# EAGLE design controller testjig (EAGLE 7.2.0)
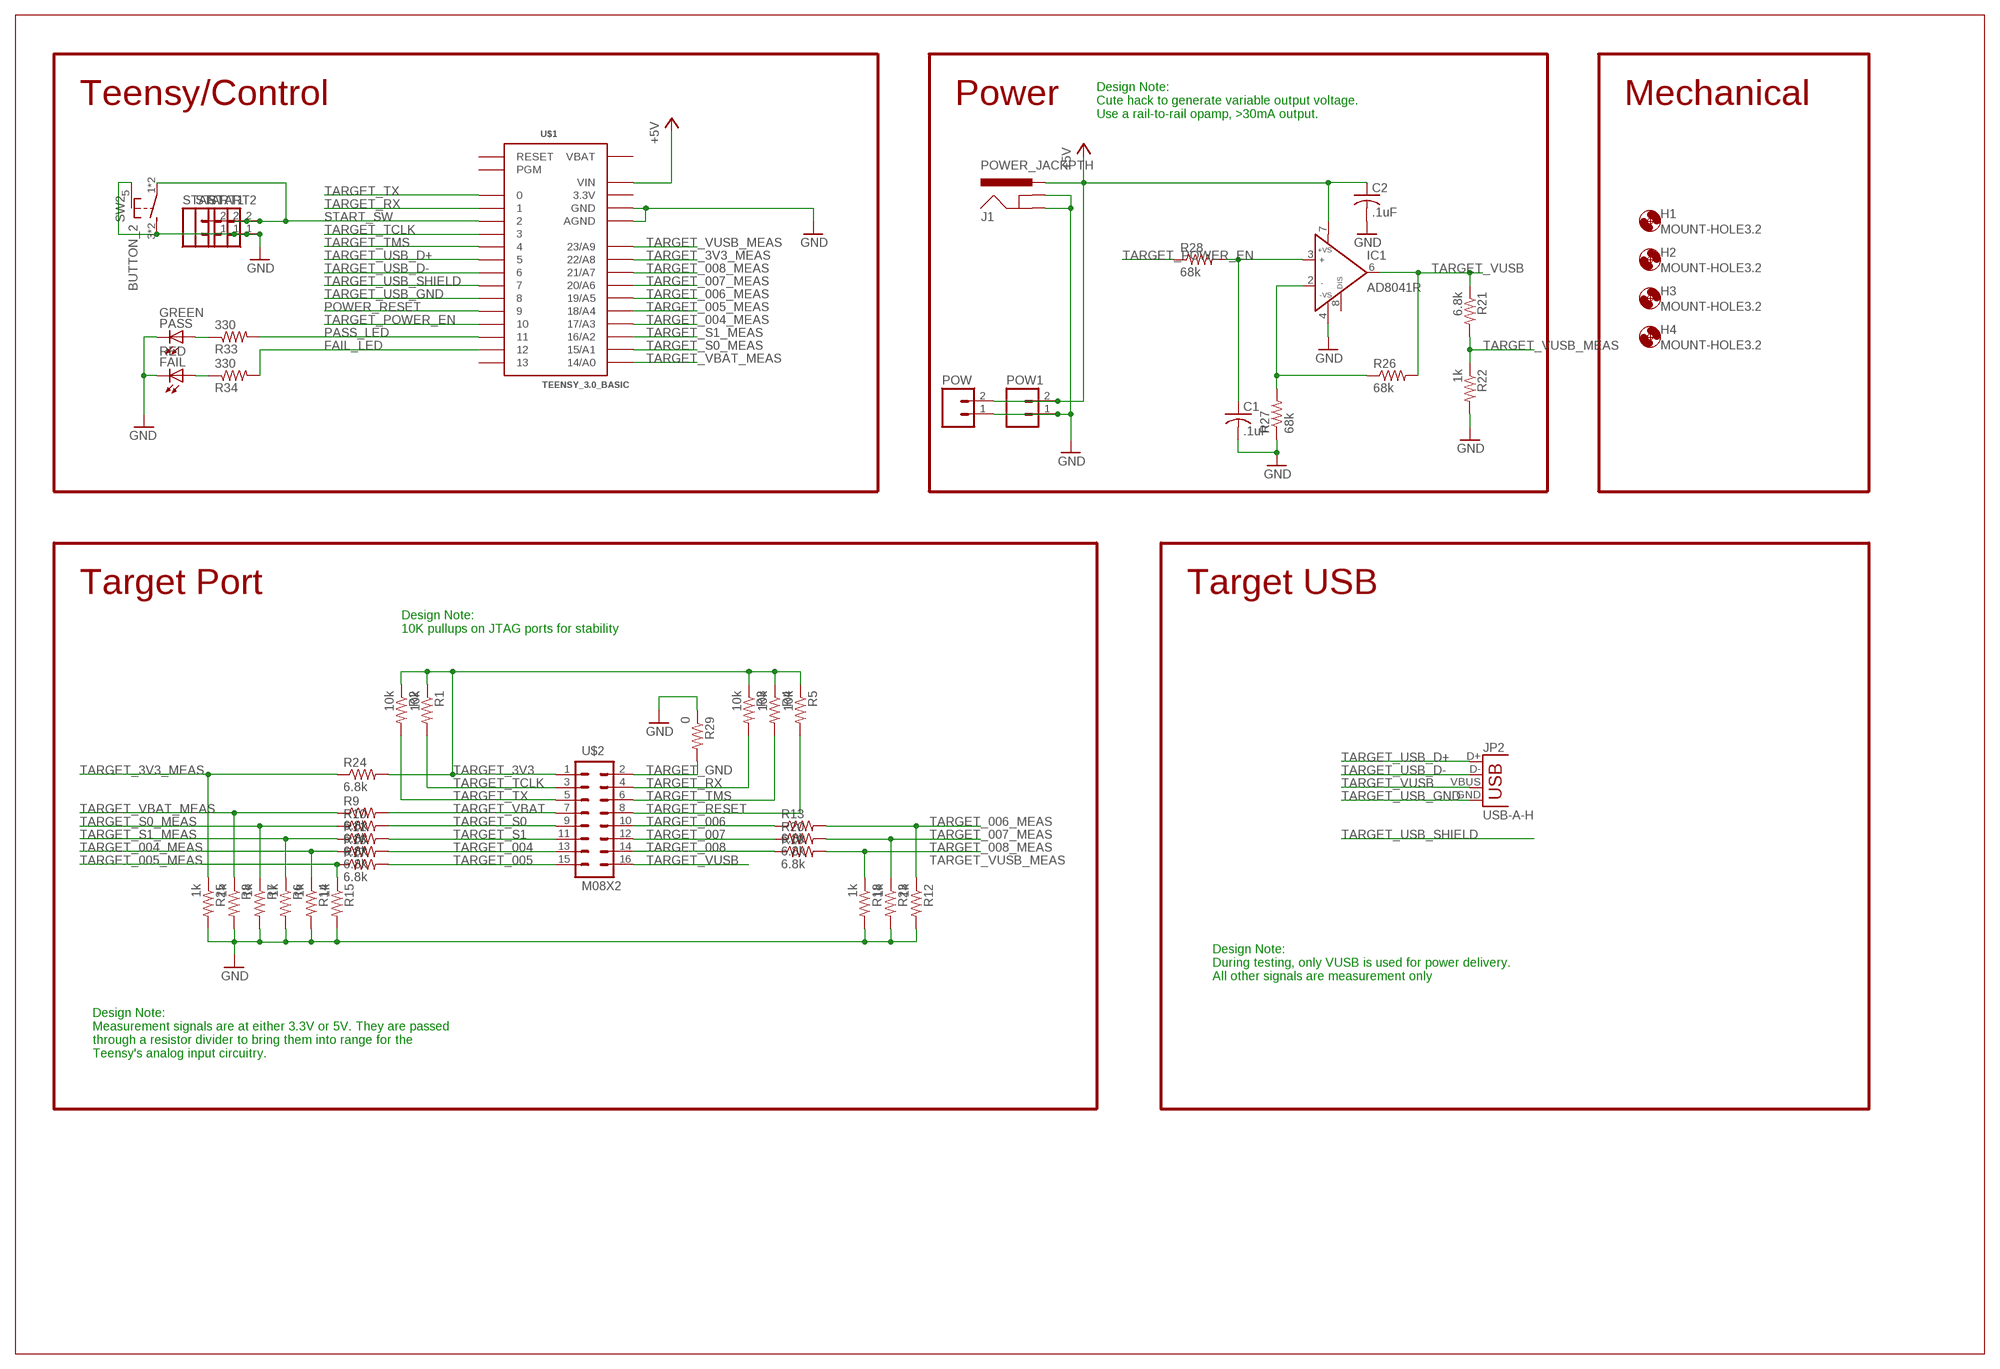
[diagram p0: schematic, sheet 1]

## Parts
C1  .1uF  C-USC0603  [C0603]
C2  .1uF  C-USC0603  [C0603]
FAIL  RED  LED5MM  [LED5MM]
H1  MOUNT-HOLE3.2  [3,2]
H2  MOUNT-HOLE3.2  [3,2]
H3  MOUNT-HOLE3.2  [3,2]
H4  MOUNT-HOLE3.2  [3,2]
IC1  AD8041R  [SO8]
J1  POWER_JACKPTH  [POWER_JACK_PTH]
JP2  USB-A-H  [USB-A-H]
PASS  GREEN  LED5MM  [LED5MM]
POW  M02  [02P]
POW1  M02  [02P]
R1  10k  R-US_R0603  [R0603]
R2  10k  R-US_R0603  [R0603]
R3  10k  R-US_R0603  [R0603]
R4  10k  R-US_R0603  [R0603]
R5  10k  R-US_R0603  [R0603]
R6  1k  R-US_R0603  [R0603]
R7  1k  R-US_R0603  [R0603]
R8  1k  R-US_R0603  [R0603]
R9  6.8k  R-US_R0603  [R0603]
R10  6.8k  R-US_R0603  [R0603]
R11  6.8k  R-US_R0603  [R0603]
R12  1k  R-US_R0603  [R0603]
R13  6.8k  R-US_R0603  [R0603]
R14  1k  R-US_R0603  [R0603]
R15  1k  R-US_R0603  [R0603]
R16  6.8k  R-US_R0603  [R0603]
R17  6.8k  R-US_R0603  [R0603]
R18  1k  R-US_R0603  [R0603]
R19  6.8k  R-US_R0603  [R0603]
R20  6.8k  R-US_R0603  [R0603]
R21  6.8k  R-US_R0603  [R0603]
R22  1k  R-US_R0603  [R0603]
R23  1k  R-US_R0603  [R0603]
R24  6.8k  R-US_R0603  [R0603]
R25  1k  R-US_R0603  [R0603]
R26  68k  R-US_R0603  [R0603]
R27  68k  R-US_R0603  [R0603]
R28  68k  R-US_R0603  [R0603]
R29  0  R-US_R0603  [R0603]
R33  330  R-US_R0603  [R0603]
R34  330  R-US_R0603  [R0603]
START  M02  [02P]
START1  M02  [02P]
START2  M02  [02P]
SW2  BUTTON_2  BUTTON_MOMENTARY_GROUND  [TD-07XB]
U$1  TEENSY_3.0_BASIC  [TEENSY_3.0_BASIC]
U$2  M08X2  [2X8]

## Nets
+5V: C2.1 IC1.7(+VS) J1.PWR POW1.2 POW.2 U$1.VIN
FAIL_LED: R34.2 U$1.12
GND: C1.2 C2.2 FAIL.K(C) IC1.4(-VS) J1.GND J1.GNDBREAK PASS.K(C) POW1.1 POW.1 R6.2 R7.2 R8.2 R12.2 R14.2 R15.2 R18.2 R22.2 R23.2 R25.2 R27.1 R29.1 START1.1 START2.1 START.1 SW2.3(S) SW2.4(S) SW2.5(SHIELD) U$1.AGND U$1.GND U$1.GND1(GND)
GOOD: PASS.A R33.1
N$1: IC1.2(IN-) R26.1 R27.2
N$3: C1.1 IC1.3(IN+) R28.2
N$52: FAIL.A R34.1
PASS_LED: R33.2 U$1.11
POWER_RESET: U$1.9
START_SW: START1.2 START2.2 START.2 SW2.1(P) SW2.2(P) U$1.2
TARGET_3V3: R1.1 R2.1 R3.1 R4.1 R5.1 R24.2 U$2.1
TARGET_3V3_MEAS: R24.1 R25.1 U$1.22/A8
TARGET_004: R16.2 U$2.13
TARGET_004_MEAS: R14.1 R16.1 U$1.17/A3
TARGET_005: R17.2 U$2.15
TARGET_005_MEAS: R15.1 R17.1 U$1.18/A4
TARGET_006: R13.1 U$2.10
TARGET_006_MEAS: R12.1 R13.2 U$1.19/A5
TARGET_007: R20.1 U$2.12
TARGET_007_MEAS: R20.2 R23.1 U$1.20/A6
TARGET_008: R19.1 U$2.14
TARGET_008_MEAS: R18.1 R19.2 U$1.21/A7
TARGET_GND: R29.2 U$2.2
TARGET_POWER_EN: R28.1 U$1.10
TARGET_RESET: R5.2 U$2.8
TARGET_RX: R3.2 U$1.1 U$2.4
TARGET_S0: R10.2 U$2.9
TARGET_S0_MEAS: R7.1 R10.1 U$1.15/A1
TARGET_S1: R11.2 U$2.11
TARGET_S1_MEAS: R6.1 R11.1 U$1.16/A2
TARGET_TCLK: R1.2 U$1.3 U$2.3
TARGET_TMS: R4.2 U$1.4 U$2.6
TARGET_TX: R2.2 U$1.0 U$2.5
TARGET_USB_D+: JP2.D+ U$1.5
TARGET_USB_D-: JP2.D- U$1.6
TARGET_USB_GND: JP2.GND U$1.8
TARGET_USB_SHIELD: U$1.7
TARGET_VBAT: R9.2 U$2.7
TARGET_VBAT_MEAS: R8.1 R9.1 U$1.14/A0
TARGET_VUSB: IC1.6(OUT) JP2.VBUS R21.1 R26.2 U$2.16
TARGET_VUSB_MEAS: R21.2 R22.1 U$1.23/A9
Unconnected: IC1.8(DISABLE) U$1.13 U$1.PGM U$1.RESET

## Notes on the sheet
- Teensy/Control | Power | Mechanical
- Design Note:
  Cute hack to generate variable output voltage.
  Use a rail-to-rail opamp, >30mA output.
- Target Port | Target USB
- Design Note:
  10K pullups on JTAG ports for stability
- Design Note:
  During testing, only VUSB is used for power delivery.
  All other signals are measurement only
- Design Note:
  Measurement signals are at either 3.3V or 5V. They are passed
  through a resistor divider to bring them into range for the
  Teensy's analog input circuitry.

## Power pins joined to a net without a drawn wire
3.3V: U$1.3.3V U$1.3.3V1(3.3V)
VBAT: U$1.VBAT

## Library data of the parts
C1 C2 = adafruit:C-US: CAPACITOR, American symbol
FAIL PASS = adafruit:LED: LED OSRAM: - CHIPLED LG R971, LG N971, LY N971, LG Q971, LY Q971, LO R971, LY R971 LH N974, LH R974 LS Q976, LO Q976, LY Q976 LO Q996 - Hyper CHIPLED LW Q18S LB Q993, LB Q99A, LB R99A - SideLED LS A670, LO A670, LY A670, LG A670, LP A670 LB A673, LV A673, LT A673, LW A673 LH A674 LY A675 LS A676, LA A676, LO A676, LY A676, LW A676 LS A679, LY A679, LG A679 - Hyper Micro SIDELED® LS Y876, LA Y876, LO Y876, LY Y876 LT Y87S - SmartLED LW L88C, LW L88S LB L89C, LB L89S, LG L890 LS L89K, LO L89K, LY L89K LS L896, LA L896, LO L896, LY L896 - TOPLED LS T670, LO T670, LY T670, LG T670, LP T670 LSG T670, LSP T670, LSY T670, LOP T670, LYG T670 LG T671, LOG T671, LSG T671 LB T673, LV T673, LT T673, LW T673 LH T674 LS T676, LA T676, LO T676, LY T676, LB T676, LH T676, LSB T676, LW T676 LB T67C, LV T67C, LT T67C, LS T67K, LO T67K, LY T67K, LW E67C LS E67B, LA E67B, LO E67B, LY E67B, LB E67C, LV E67C, LT E67C LW T67C LS T679, LY T679, LG T679 LS T770, LO T770, LY T770, LG T770, LP T770 LB T773, LV T773, LT T773, LW T773 LH T774 LS E675, LA E675, LY E675, LS T675 LS T776, LA T776, LO T776, LY T776, LB T776 LHGB T686 LT T68C, LB T68C - Hyper Mini TOPLED® LB M676 - Mini TOPLED Santana® LG M470 LS M47K, LO M47K, LY M47K Source: http://www.osram.convergy.de/
H1-H4 = holes:MOUNT-HOLE: MOUNTING HOLE with drill center marker
IC1 = analog-devices:AD8041: 160 MHz Rail-to-Rail Amplifier with Disable Source: http://www.analog.com/static/imported-files/data_sheets/AD8041.pdf; MF: ALTERA CORPORATION; MPN: AD8041ARZ; OC_FARNELL: 1464831; OC_NEWARK: 88H0130
J1 = SparkFun-Connectors:POWER_JACK: Power Jack This is the standard 5.5mm barrel jack for power. The PTH is the most common, proven, reliable, footprint. The Slot footprint only works if the mill layer is transmitted to the PCB fab house so be warned. Spark Fun Electronics SKU : PRT-00119 SMT: CONN-08106 Mating wall wart : TOL-00298 (and others)
JP2 = SparkFun-Connectors:USB: USB Connectors USB-B-PTH is fully proven SKU : PRT-00139/CONN-08278 USB-miniB is fully proven SKU : PRT-00587 USB-A-PCB is untested. USB-A-H is throughly reviewed, but untested. Spark Fun Electronics SKU : PRT-00437 USB-B-SMT is throughly reviewed, but untested. Needs silkscreen touching up. USB-A-S has not been used/tested USB-MB-H has not been used/tested USB-MICROB has been used. CONN-09505; PROD_ID: CONN-08367
POW POW1 START START1 START2 = con-amp-quick:M02: AMP QUICK CONNECTOR; OC_FARNELL: unknown; OC_NEWARK: unknown
R1-R29 R33 R34 = adafruit:R-US_: RESISTOR, American symbol
SW2 = blinkinlabs:BUTTON_MOMENTARY_GROUND
U$1 = Teensy3.0:TEENSY_3.0_BASIC: Basic Teensy 3.0 with none of the 'inner' pins enabled. See '+4', 'AllAnalogPins", and 'AllPins' packages for additional pin holes, as needed.
U$2 = SparkFun-Connectors:M08X2: .1" headers, two rows of 8 each

## Board
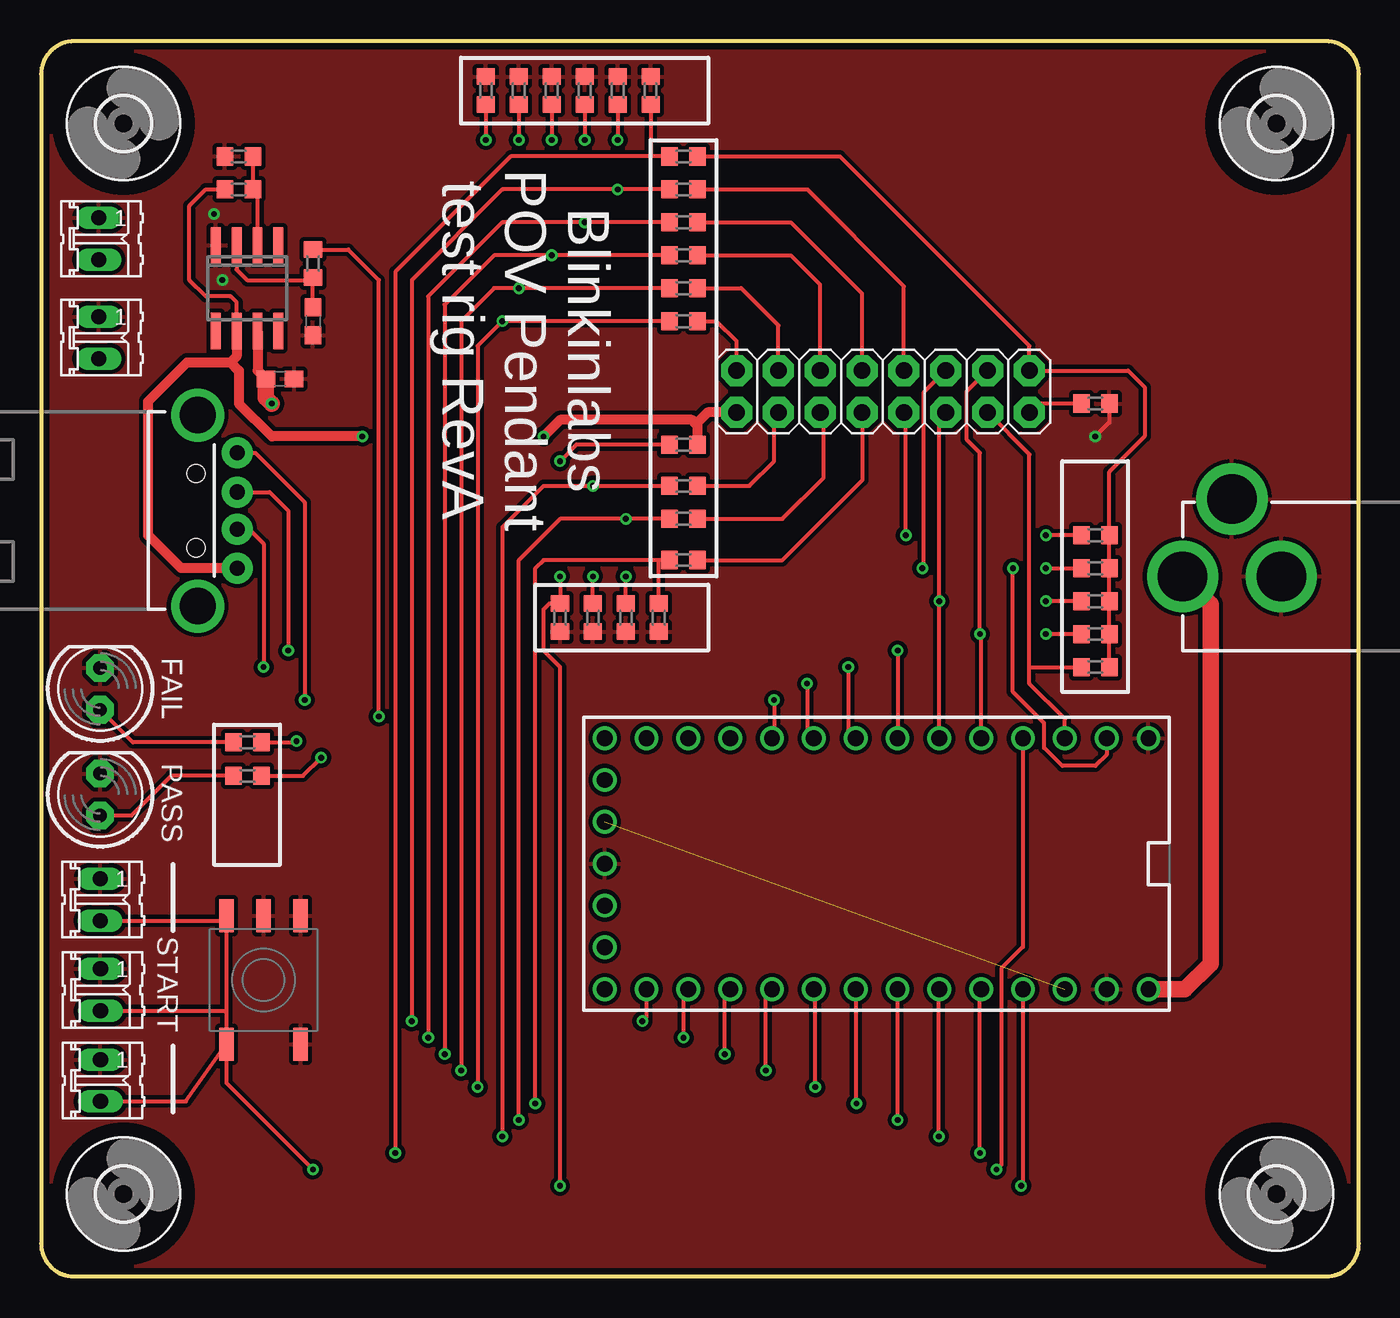
[diagram p1: board, top side]
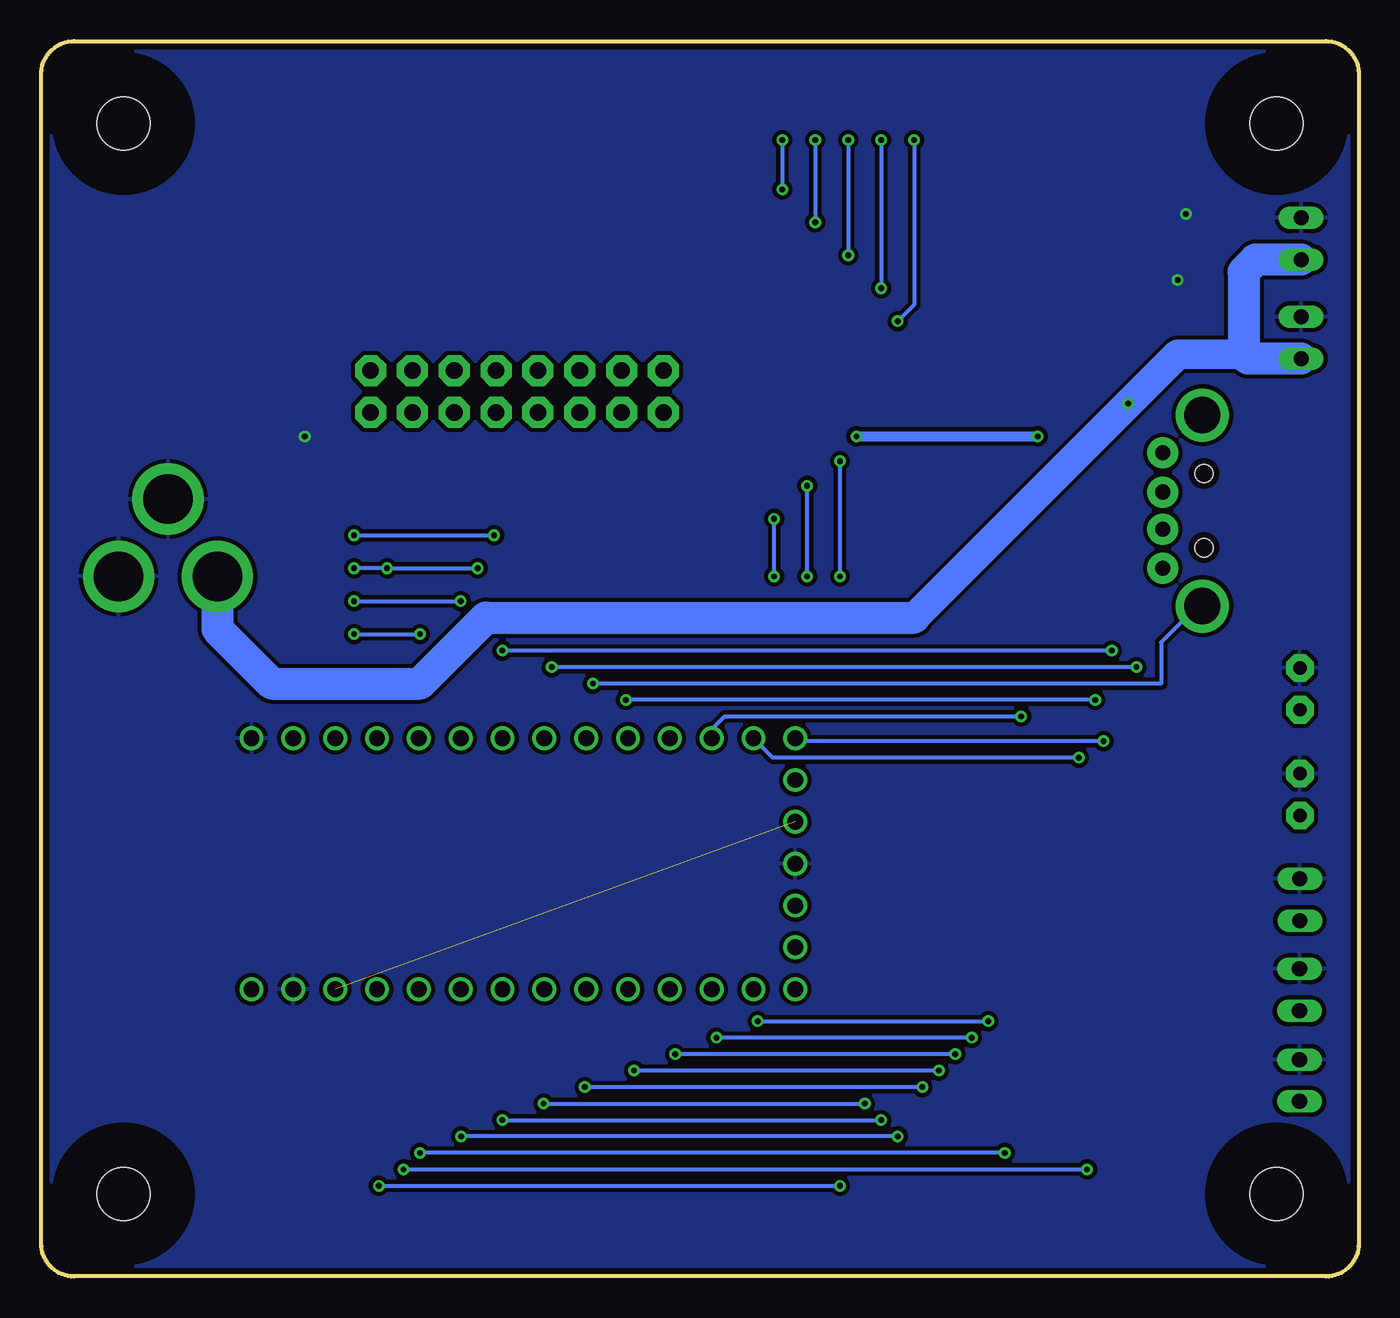
[diagram p2: board, bottom side, seen from below]

Size 80 x 75 mm. Coordinates in mm from the lower left corner, seen from the top.
Outline: 0,73 0,2 arc90 2,0 78,0 arc90 80,2 80,73 arc90 78,75 2,75 arc90 0,73
Copper layers (1*16): Top 0.0356mm / dielectric 1.5011mm / Bottom 0.0356mm
Design rules "BlinkyTape": minimum track width 8mil, minimum drill 10mil, track to track 8mil, track to pad 8mil, pad to pad 8mil, via to via 8mil, smd to smd 8mil, copper to edge 15mil, drill to drill 0.25mm, minimum pad ring 7mil, minimum via ring 7mil, stop-mask expansion 2mil, vias tented up to drill 10mil, thermal gap 10mil

### Footprints (pad centres in the part's own frame; a part is rotated, then mirrored left to right if it is on the bottom)
C0603 = smd 1.1 x 1: 1 -0.85,0; 2 0.85,0
LED5MM = drill 0.813 pad 1.676 octagon: A -1.27,0; K 1.27,0
3,2 = hole 3.2: 0,0
SO8 = smd 0.6 x 2.2: 1 -1.905,-2.6; 2 -0.635,-2.6; 3 0.635,-2.6; 4 1.905,-2.6; 5 1.905,2.6; 6 0.635,2.6; 7 -0.635,2.6; 8 -1.905,2.6
POWER_JACK_PTH = drill 2.997 pad 4.318: GND 0,7.7; GNDBREAK 4.7,10.7; PWR 0,13.7
USB-A-H = drill 0.914 pad 1.88: D+ 2.4,1.127; D- 2.4,-1.127; GND 2.4,3.5; VBUS 2.4,-3.5 | drill 2.2: GND2 0,-5.8; GND3 0,5.8 | hole 1.1: -0.1,2.25; -0.1,-2.25
02P = drill 0.914 long: 1 -1.27,0; 2 1.27,0
R0603 = smd 1 x 1.1: 1 -0.85,0; 2 0.85,0
TD-07XB = smd 2 x 0.9: 1 -3.9,-2.25; 2 3.9,-2.25; 3 -3.9,2.25; 4 3.9,2.25; 5 -3.9,0
TEENSY_3.0_BASIC = drill 0.965: 0 -7.62,13.97; 1 -7.62,11.43; 2 -7.62,8.89; 3 -7.62,6.35; 3.3V 7.62,11.43; 3.3V1 -2.54,-16.51; 4 -7.62,3.81; 5 -7.62,1.27; 6 -7.62,-1.27; 7 -7.62,-3.81; 8 -7.62,-6.35; 9 -7.62,-8.89; 10 -7.62,-11.43; 11 -7.62,-13.97; 12 -7.62,-16.51; 13 7.62,-16.51; 14/A0 7.62,-13.97; 15/A1 7.62,-11.43; 16/A2 7.62,-8.89; 17/A3 7.62,-6.35; 18/A4 7.62,-3.81; 19/A5 7.62,-1.27; 20/A6 7.62,1.27; 21/A7 7.62,3.81; 22/A8 7.62,6.35; 23/A9 7.62,8.89; AGND 7.62,13.97; GND -7.62,16.51; GND1 0,-16.51; PGM 2.54,-16.51; RESET 5.08,-16.51; VBAT -5.08,-16.51; VIN 7.62,16.51
2X8 = drill 1.016 pad 1.88 octagon: 1 0,0; 2 0,2.54; 3 2.54,0; 4 2.54,2.54; 5 5.08,0; 6 5.08,2.54; 7 7.62,0; 8 7.62,2.54; 9 10.16,0; 10 10.16,2.54; 11 12.7,0; 12 12.7,2.54; 13 15.24,0; 14 15.24,2.54; 15 17.78,0; 16 17.78,2.54

### Placement (x,y rotation side)
C1  16.5,58 270 top
C2  14.5,54.5 0 top
FAIL  3.58,35.68 90 top
H1  5,5 0 top
H2  5,70 0 top
H3  75,70 0 top
H4  75,5 0 top
IC1  12.5,60 180 top
J1  83,42.5 90 top
JP2  9.5,46.5 0 top
PASS  3.58,29.26 90 top
POW  3.5,57 270 top
POW1  3.5,63 270 top
R1  64,39 180 top
R2  64,43 180 top
R3  64,37 180 top
R4  64,41 180 top
R5  64,45 180 top
R6  31,72 90 top
R7  33,72 90 top
R8  35,72 90 top
R9  39,66 0 top
R10  39,64 0 top
R11  39,62 0 top
R12  37.5,40 270 top
R13  39,43.5 180 top
R14  29,72 90 top
R15  27,72 90 top
R16  39,60 0 top
R17  39,58 0 top
R18  33.5,40 270 top
R19  39,48 180 top
R20  39,46 180 top
R21  39,50.5 180 top
R22  31.5,40 270 top
R23  35.5,40 270 top
R24  39,68 0 top
R25  37,72 90 top
R26  12,66 180 top
R27  12,68 0 top
R28  16.5,61.5 270 top
R29  64,53 180 top
R33  12.52,30.39 0 top
R34  12.52,32.43 0 top
START  3.58,22.88 270 top
START1  3.6,17.4 270 top
START2  3.6,11.9 270 top
SW2  13.5,18 270 top
U$1  50.72,25.06 270 top
U$2  60,55 180 top

### Tracks (layer width: path | path; a pad name or v marks a point on that pad's centre or on a via)
3.3V  (1 unrouted)
+5V  (via drill 0.35)
  Top 0.61: IC1.7 13.13,55.02 C2.1
  Top 1.016: C2.1 13.65,53.35 v14,53 | U$1.VIN 69.44,17.44 71,19 71,40.8 J1.PWR
  Bottom 1.778: 7,56 11,56 v14,53 27,40
  Bottom 1.93: J1.PWR 69.3,39.3 66,36 57,36 53,40 27,40 | POW1.2 6.27,61.73 7,61 7,56 6.73,55.73 POW.2
FAIL_LED  (via drill 0.35)
  Top 0.254: R34.2 15.43,32.43 v15.5,32.5
  Bottom 0.254: v15.5,32.5 34.03,32.5 U$1.12
GND  (via drill 0.35)
  Top 0.254: R29.1 64.85,51.85 v64,51
  other vias: 10.5,64.5 11,60.5
  pour Top (isolate 0.254): 0,75 80,75 80,0 0,0
  pour Bottom (isolate 0.254): 0,75 0,0 80,0 80,75
GOOD
  Top 0.254: PASS.A 5.49,27.99 7.89,30.39 R33.1
N$1
  Top 0.254: IC1.2 13.13,65.72 R26.1 R27.2
N$3
  Top 0.254: IC1.3 11.87,61.13 12.5,60.5 16.35,60.5 R28.2 C1.1
N$52
  Top 0.254: R34.1 5.56,32.43 FAIL.A
PASS_LED  (via drill 0.35)
  Top 0.254: R33.2 15.89,30.39 v17,31.5
  Bottom 0.254: v17,31.5 35.57,31.5 U$1.11
START_SW  (via drill 0.35)
  Top 0.254: U$1.2 59.61,20.01 58.3,18.7 58.3,6.8 v58,6.5 | 11.25,16 SW2.1 10.96,21.61 START.2 | 11.25,16 SW2.2 | SW2.2 11.25,11.75 v16.5,6.5 | START1.2 11.12,16.13 11.25,16 | START2.2 8.78,10.63 SW2.2
  Bottom 0.254: v58,6.5 v16.5,6.5
TARGET_3V3
  Top 0.254: R3.1 R1.1 R4.1 R2.1 R5.1 64.85,48.85 67,51 67,54 66,55 U$2.1 60,56.5 48.5,68 R24.2
TARGET_3V3_MEAS  (via drill 0.35)
  Top 0.254: R24.1 37,68 | 37,68 28.5,68 21.5,61 v21.5,7.5 | v57,7.5 57,17.37 U$1.22/A8 | R25.1 37,68
  Bottom 0.254: v21.5,7.5 v57,7.5
TARGET_004
  Top 0.254: R16.2 42.5,60 44.76,57.74 U$2.13
TARGET_004_MEAS  (via drill 0.35)
  Top 0.254: R16.1 v29,60 27.5,60 25.5,58 v25.5,12.5 | v44,12.5 44,17.07 U$1.17/A3 | R14.1 v29,69
  Bottom 0.254: v25.5,12.5 v44,12.5 | v29,69 v29,60
TARGET_005
  Top 0.254: R17.2 41,58 42.22,56.78 U$2.15
TARGET_005_MEAS  (via drill 0.35)
  Top 0.254: R17.1 v28,58 26.5,56.5 v26.5,11.5 | v47,11.5 47,17.35 U$1.18/A4 | R15.1 v27,69
  Bottom 0.254: v26.5,11.5 v47,11.5 | v27,69 27,59 v28,58
TARGET_006
  Top 0.254: U$2.10 49.84,48.34 45,43.5 R13.1
TARGET_006_MEAS  (via drill 0.35)
  Top 0.254: U$1.19/A5 49.45,10.55 v49.5,10.5 | v30,10.5 30,43 30.5,43.5 37.5,43.5 | R13.2 37.5,43.5 | R12.1 37.5,43.5
  Bottom 0.254: v49.5,10.5 v30,10.5
TARGET_007
  Top 0.254: U$2.12 47.5,52.26 47.5,48.5 45,46 R20.1
TARGET_007_MEAS  (via drill 0.35)
  Top 0.254: U$1.20/A6 v51.99,9.51 v52,9.5 | v29,9.5 29,43.5 31.5,46 v35.5,46 R20.2 | R23.1 v35.5,42.5
  Bottom 0.254: v52,9.5 v29,9.5 | v35.5,42.5 v35.5,46
TARGET_008
  Top 0.254: U$2.14 44.5,52.2 44.5,49.5 43,48 R19.1
TARGET_008_MEAS  (via drill 0.35)
  Top 0.254: 38,48 R19.2 v33.5,48 30.5,48 28,45.5 v28,8.5 | v54.5,8.5 54.5,17.41 U$1.21/A7 | R18.1 v33.5,42.5
  Bottom 0.254: v28,8.5 v54.5,8.5 | v33.5,42.5 v33.5,48
TARGET_GND
  Top 0.254: R29.2 60.54,53 U$2.2
TARGET_POWER_EN  (via drill 0.35)
  Top 0.254: v20.5,34 20.5,60.5 18.65,62.35 R28.1
  Bottom 0.254: U$1.10 39.29,33.21 38.5,34 v20.5,34
TARGET_RESET  (via drill 0.35)
  Top 0.254: R5.2 v61,45 | v52.5,45 52.5,52.24 52.38,52.36 U$2.8
  Bottom 0.254: v61,45 v52.5,45
TARGET_RX
  Top 0.254: 60,37 R3.2 | U$1.1 62.15,33.85 60,36 60,37 | 60,37 60,49.92 U$2.4
TARGET_S0
  Top 0.254: R10.2 45.5,64 49.84,59.66 U$2.9
TARGET_S0_MEAS  (via drill 0.35)
  Top 0.254: R10.1 v33,64 28,64 23.5,59.5 v23.5,14.5 | v39,14.5 39,17.15 U$1.15/A1 | R7.1 v33,69
  Bottom 0.254: v23.5,14.5 v39,14.5 | v33,69 v33,64
TARGET_S1
  Top 0.254: R11.2 45.5,62 47.3,60.2 U$2.11
TARGET_S1_MEAS  (via drill 0.35)
  Top 0.254: R11.1 v31,62 27.5,62 24.5,59 v24.5,13.5 | v41.5,13.5 41.5,17.11 U$1.16/A2 | R6.1 v31,69
  Bottom 0.254: v24.5,13.5 v41.5,13.5 | v31,69 v31,62
TARGET_TCLK  (via drill 0.35)
  Top 0.254: U$1.3 57.07,38.93 v57,39 57,50 56.2,50.8 56.2,53.74 U$2.3 | R1.2 v61,39
  Bottom 0.254: v61,39 v57,39
TARGET_TMS  (via drill 0.35)
  Top 0.254: U$1.4 v54.53,41 54.53,52.07 U$2.6 | R4.2 v61,41
  Bottom 0.254: v61,41 v54.53,41
TARGET_TX  (via drill 0.35)
  Top 0.254: U$1.0 64.69,31.69 64,31 62,31 60.9,32.1 60.9,33.6 59,35.5 v59,43 | v61,43 R2.2 | v53.5,43 53.6,43 53.6,53.68 U$2.5
  Bottom 0.254: v61,43 v59,43 v53.5,43
TARGET_USB_D+  (via drill 0.35)
  Top 0.254: v52,38 U$1.5 | JP2.D+ 13.87,47.63 15,46.5 v15,38
  Bottom 0.254: v15,38 v52,38
TARGET_USB_D-  (via drill 0.35)
  Top 0.254: v49,37 49,33.13 U$1.6 | JP2.D- 12.63,45.37 13.5,44.5 v13.5,37
  Bottom 0.254: v13.5,37 v49,37
TARGET_USB_GND  (via drill 0.35)
  Top 0.254: v44.5,35 44.5,32.81 U$1.8 | JP2.GND 13,50 16,47 v16,35
  Bottom 0.254: v16,35 v44.5,35
TARGET_USB_SHIELD  (via drill 0.35)
  Top 0.254: v46.5,36 46.5,33.09 U$1.7
  Bottom 0.254: 9.5,41 12,38.5 12,36 v46.5,36
TARGET_VBAT
  Top 0.254: U$2.7 52.38,60.12 46.5,66 R9.2
TARGET_VBAT_MEAS  (via drill 0.35)
  Top 0.254: R9.1 v35,66 28,66 22.5,60.5 v22.5,15.5 | U$1.14/A0 36.75,15.75 v36.5,15.5 | R8.1 v35,69
  Bottom 0.254: v36.5,15.5 v22.5,15.5 | v35,69 v35,66
TARGET_VUSB  (via drill 0.35)
  Top 0.254: IC1.6 11.87,59.13 11.5,59.5 10,59.5 9,60.5 9,65 10,66 R26.2
  Top 0.61: R21.1 39.85,51.65 39.75,51.75 | 39.75,51.75 39.5,52 31.5,52 v30.5,51 | JP2.VBUS 8.5,43 6.5,45 6.5,53.13 8.87,55.5 11.5,55.5 | v19.5,51 14,51 12,53 12,55 11.5,55.5 | IC1.6 11.87,55.87 11.5,55.5 | U$2.16 40.46,52.46 39.75,51.75
  Bottom 0.61: v30.5,51 v19.5,51
TARGET_VUSB_MEAS  (via drill 0.35)
  Top 0.254: U$1.23/A9 59.61,5.61 v59.5,5.5 | v31.5,5.5 31.5,37 30.5,38 30.5,40.5 30.85,40.85 R22.1 v31.5,42.5 | R21.2 32.5,50.5 v31.5,49.5
  Bottom 0.254: v59.5,5.5 v31.5,5.5 | v31.5,49.5 v31.5,42.5

### Text on the board
tNames: Blinkinlabs / POV Pendant / test rig RevA
tDocu: 1k | + - | + - | 005 | 004 | S1 | S0 | VBAT | TX | TCLK | 3.3V | 6.8k | 008 | 007 | 006 | RST | TMS | RX | GND | 10k | 1k | 330 | TEEEEEEEE / EEENSY3.0